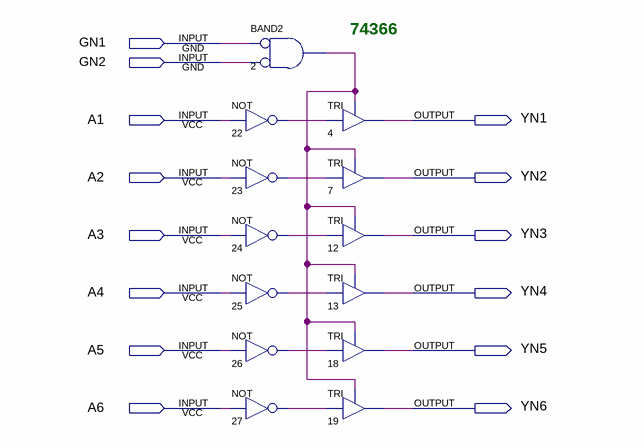
[diagram p0: schematic sheet]
// Quartus schematic 74366.bdf as structural Verilog: 13 symbols, 14 pins
module \74366  (
  input  GN1,
  input  GN2,
  input  A1,
  input  A2,
  input  A3,
  input  A4,
  input  A5,
  input  A6,
  output YN1,
  output YN2,
  output YN3,
  output YN4,
  output YN5,
  output YN6
);

  wire n2_out, n22_out, n23_out, n24_out, n25_out, n26_out, n27_out;

  not u_22 (n22_out, A1);
  not u_23 (n23_out, A2);
  not u_24 (n24_out, A3);
  not u_25 (n25_out, A4);
  not u_26 (n26_out, A5);
  not u_27 (n27_out, A6);
  and u_2 (n2_out, ~GN1, ~GN2);  // BAND2
  TRI u_4 (.IN(n22_out), .OE(n2_out), .OUT(YN1));
  TRI u_7 (.IN(n23_out), .OE(n2_out), .OUT(YN2));
  TRI u_12 (.IN(n24_out), .OE(n2_out), .OUT(YN3));
  TRI u_13 (.IN(n25_out), .OE(n2_out), .OUT(YN4));
  TRI u_18 (.IN(n26_out), .OE(n2_out), .OUT(YN5));
  TRI u_19 (.IN(n27_out), .OE(n2_out), .OUT(YN6));

  // Notes on the sheet:
  //   74366
endmodule
